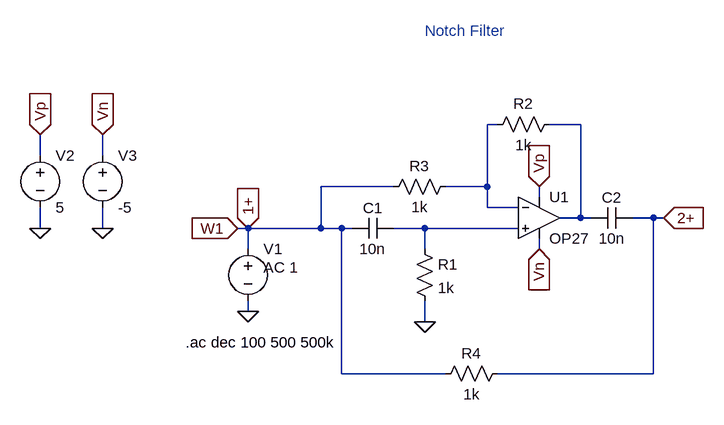
[diagram p0: schematic notch_filt.asc]
notch_filt.asc, the LTspice schematic file:
Version 4
SHEET 1 880 680
WIRE 288 64 272 64
WIRE 416 64 368 64
WIRE -416 112 -416 80
WIRE -320 112 -320 80
WIRE 128 160 16 160
WIRE 272 160 272 64
WIRE 272 160 208 160
WIRE 352 176 352 160
WIRE 272 192 272 160
WIRE 320 192 272 192
WIRE 416 208 416 64
WIRE 416 208 384 208
WIRE 432 208 416 208
WIRE 528 208 496 208
WIRE 544 208 528 208
WIRE -416 224 -416 192
WIRE -320 224 -320 192
WIRE -96 224 -112 224
WIRE 16 224 16 160
WIRE 16 224 -96 224
WIRE 48 224 16 224
WIRE 64 224 48 224
WIRE 176 224 128 224
WIRE 320 224 176 224
WIRE -96 256 -96 224
WIRE 176 256 176 224
WIRE 352 256 352 240
WIRE -96 352 -96 336
WIRE 176 368 176 336
WIRE 48 448 48 224
WIRE 208 448 48 448
WIRE 528 448 528 208
WIRE 528 448 288 448
FLAG 176 368 0
FLAG -96 352 0
FLAG -416 224 0
FLAG -320 224 0
FLAG -416 80 Vp
IOPIN -416 80 In
FLAG -320 80 Vn
IOPIN -320 80 In
FLAG 352 160 Vp
IOPIN 352 160 In
FLAG 352 256 Vn
IOPIN 352 256 In
FLAG 544 208 2+
IOPIN 544 208 In
FLAG -112 224 W1
IOPIN -112 224 In
FLAG -96 224 1+
IOPIN -96 224 In
SYMBOL Opamps\\OP27 352 144 R0
SYMATTR InstName U1
SYMBOL cap 128 208 R90
WINDOW 0 0 32 VBottom 2
WINDOW 3 32 32 VTop 2
SYMATTR InstName C1
SYMATTR Value 10n
SYMBOL res 160 240 R0
SYMATTR InstName R1
SYMATTR Value 1k
SYMBOL res 384 48 R90
WINDOW 0 0 56 VBottom 2
WINDOW 3 32 56 VTop 2
SYMATTR InstName R2
SYMATTR Value 1k
SYMBOL res 224 144 R90
WINDOW 0 0 56 VBottom 2
WINDOW 3 32 56 VTop 2
SYMATTR InstName R3
SYMATTR Value 1k
SYMBOL voltage -96 240 R0
WINDOW 123 24 44 Left 2
WINDOW 39 0 0 Left 0
SYMATTR Value2 AC 1
SYMATTR InstName V1
SYMATTR Value ""
SYMBOL voltage -416 96 R0
WINDOW 123 0 0 Left 0
WINDOW 39 0 0 Left 0
SYMATTR InstName V2
SYMATTR Value 5
SYMBOL voltage -320 96 R0
WINDOW 123 0 0 Left 0
WINDOW 39 0 0 Left 0
SYMATTR InstName V3
SYMATTR Value -5
SYMBOL res 304 432 R90
WINDOW 0 0 56 VBottom 2
WINDOW 3 32 56 VTop 2
SYMATTR InstName R4
SYMATTR Value 1k
SYMBOL cap 496 192 R90
WINDOW 0 0 32 VBottom 2
WINDOW 3 32 32 VTop 2
SYMATTR InstName C2
SYMATTR Value 10n
TEXT -192 400 Left 2 !.ac dec 100 500 500k
TEXT 176 -80 Left 2 ;Notch Filter

The netlist it stands for:
* notch_filt.asc
XU1 N003 N001 Vp Vn N002 OP27  ; pins In+ In- V+ V- OUT
C1 N003 1+ 10n
R1 N003 0 1k
R2 N002 N001 1k
R3 N001 1+ 1k
V1 1+ 0 AC 1
V2 Vp 0 5
V3 Vn 0 -5
R4 2+ 1+ 1k
C2 2+ N002 10n
.ac dec 100 500 500k
* Notch Filter
.lib ADI.lib
.backanno
.end